# Altium schematic sheet RX-DESIGN.schdoc
size A3
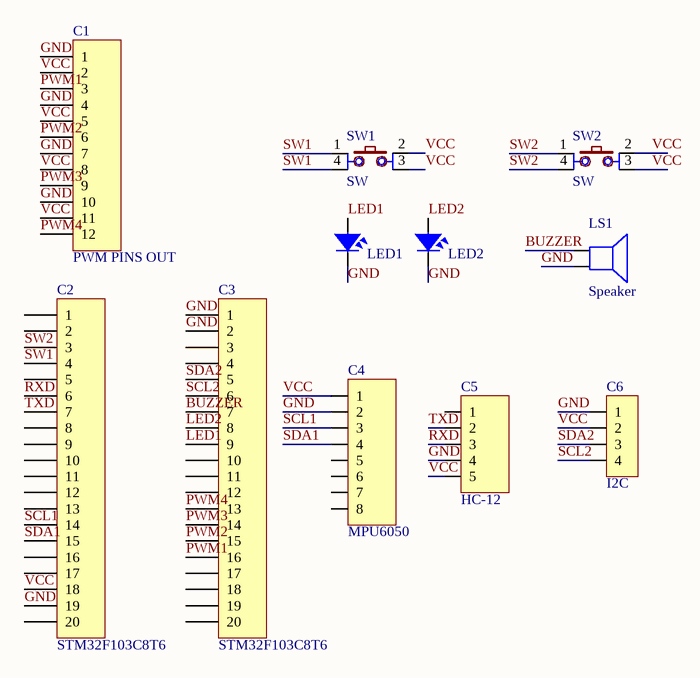
[diagram p0: RX-DESIGN.schdoc]

## Parts
C1  PWM PINS OUT  [JP12-D1T]
C2  STM32F103C8T6  [JP20-C1T]
C3  STM32F103C8T6  [JP20-C1T]
C4  MPU6050  [JP8-C1C]
C5  HC-12  [JP5-C1T]
C6  I2C  [JP4-C1T]
LED1  LED  [LED-3MM-YELLOW]  (value not drawn)
LED2  LED  [LED-3MM-YELLOW]  (value not drawn)
LS1  Speaker  [SPEAKER]
SW1  SW  [SW2-DIP]
SW2  SW  [SW2-DIP]

## Nets
BUZZER: C3.7 LS1.1
GND: C1.1 C1.4 C1.7 C1.10 C2.19 C3.1 C3.2 C4.2 C5.4 C6.1 LED1.2 LED2.2 LS1.2
LED1: C3.9 LED1.1
LED2: C3.8 LED2.1
PWM1: C1.3 C3.16
PWM2: C1.6 C3.15
PWM3: C1.9 C3.14
PWM4: C1.12 C3.13
RXD: C2.6 C5.3
SCL1: C2.14 C4.3
SCL2: C3.6 C6.4
SDA1: C2.15 C4.4
SDA2: C3.5 C6.3
SW1: C2.4 SW1.1 SW1.4
SW2: C2.3 SW2.1 SW2.4
TXD: C2.7 C5.2
VCC: C1.2 C1.5 C1.8 C1.11 C2.18 C4.1 C5.5 C6.2 SW1.2 SW1.3 SW2.2 SW2.3

Not connected (* = marked no-connect by the designer): C2 1 2 5 8 9 10 11 12 13 16 17 20; C3 3 4 10 11 12 17 18 19 20; C4 5 6 7 8; C5 1

## Library data of the parts
C1 = JP12: WR-PHD 2.54 mm Angled Socket Header; Manufacturer: W¨¹rth Elektronik eiSos GmbH; partNo: 613012143121; ComponentLink1 Description: Manufacturer; ComponentLink2 Description: Datasheet; NoPins: 12; Created Date: 29 March 2013; ComponentLink1URL: http://www.we-online.com; ComponentLink2URL: http://katalog.we-online.de/em/datasheet/6130xx143121.pdf; Created by: Karrer Zheng
C2 C3 = JP20: WR-PHD 2.54 mm Angled Socket Header; Manufacturer: W¨¹rth Elektronik eiSos GmbH; partNo: 613020143121; ComponentLink1 Description: Manufacturer; ComponentLink2 Description: Datasheet; NoPins: 20; Created Date: 29 March 2013; ComponentLink1URL: http://www.we-online.com; ComponentLink2URL: http://katalog.we-online.de/em/datasheet/6130xx143121.pdf; Created by: Karrer Zheng
C4 = JP8: WR-PHD 2.54 mm Angled Socket Header; Manufacturer: W¨¹rth Elektronik eiSos GmbH; partNo: 613008143121; ComponentLink1 Description: Manufacturer; ComponentLink2 Description: Datasheet; NoPins: 08; Created Date: 29 March 2013; ComponentLink1URL: http://www.we-online.com; ComponentLink2URL: http://katalog.we-online.de/em/datasheet/6130xx143121.pdf; Created by: Karrer Zheng
C5 = JP5: WR-PHD 2.54 mm Angled Socket Header; Manufacturer: W¨¹rth Elektronik eiSos GmbH; partNo: 613005143121; ComponentLink1 Description: Manufacturer; ComponentLink2 Description: Datasheet; NoPins: 05; Created Date: 29 March 2013; ComponentLink1URL: http://www.we-online.com; ComponentLink2URL: http://katalog.we-online.de/em/datasheet/6130xx143121.pdf; Created by: Karrer Zheng
C6 = JP4: WR-PHD 2.54 mm Angled Socket Header; Manufacturer: W¨¹rth Elektronik eiSos GmbH; partNo: 613004143121; ComponentLink1 Description: Manufacturer; ComponentLink2 Description: Datasheet; NoPins: 04; Created Date: 29 March 2013; ComponentLink1URL: http://www.we-online.com; ComponentLink2URL: http://katalog.we-online.de/em/datasheet/6130xx143121.pdf; Created by: Karrer Zheng
LED1 LED2 = LED: LED Single colour Green and Red; Value: LED 3 ly Single Colour
LS1 = Speaker: Loudspeaker; Published: 24-Mar-1999; LatestRevisionDate: 17-Jul-2002; LatestRevisionNote: Re-released for DXP Platform.; PackageReference: PIN2; Publisher: Altium Limited
SW1 SW2 = SW4: Switch button 4 pin; Value: Button chip 4 pin